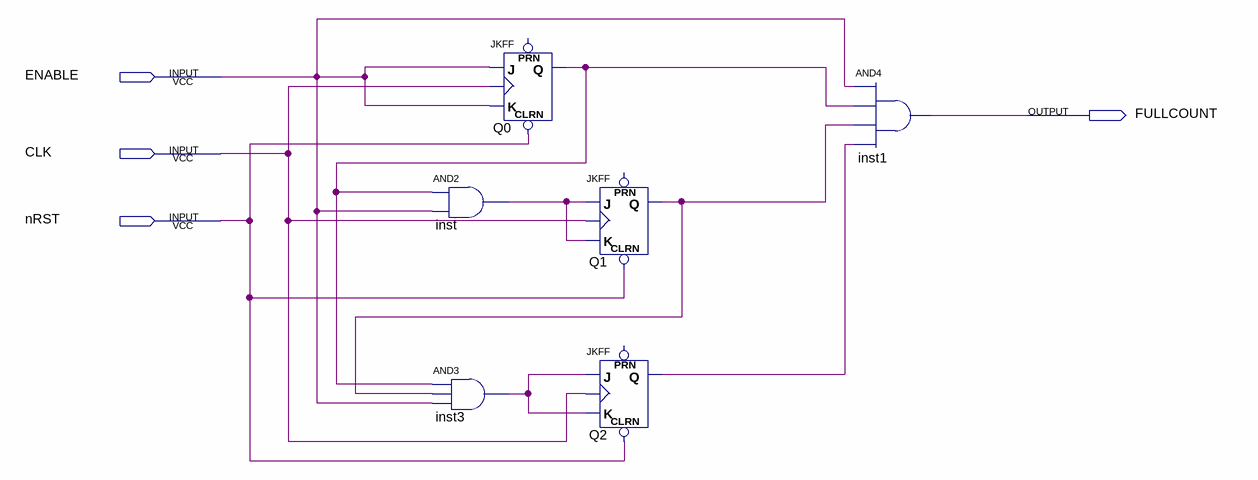
[diagram p0: schematic sheet]
// Quartus schematic ContadorCiclos7.bdf as structural Verilog: 6 symbols, 4 pins
module ContadorCiclos7 (
  input  ENABLE,
  input  CLK,
  input  nRST,
  output FULLCOUNT
);

  wire inst3_out, inst_out, Q0_q, Q1_q, Q2_q;

  and inst (inst_out, Q0_q, ENABLE);
  and inst3 (inst3_out, Q0_q, Q1_q, ENABLE);
  JKFF Q0 (.CLRN(nRST), .K(ENABLE), .J(ENABLE), .CLK(CLK), .Q(Q0_q));  // open: PRN
  JKFF Q1 (.CLRN(nRST), .K(inst_out), .J(inst_out), .CLK(CLK), .Q(Q1_q));  // open: PRN
  JKFF Q2 (.CLRN(nRST), .K(inst3_out), .J(inst3_out), .CLK(CLK), .Q(Q2_q));  // open: PRN
  and inst1 (FULLCOUNT, ENABLE, Q0_q, Q1_q, Q2_q);
endmodule
